# EasyEDA schematic 1-Schematic_ESP32_Wroom_mini.json
TITLE: Sheet_1; REV: 1.0; Date: 2023-05-23; Sheet: 1/1; Company: Your Company
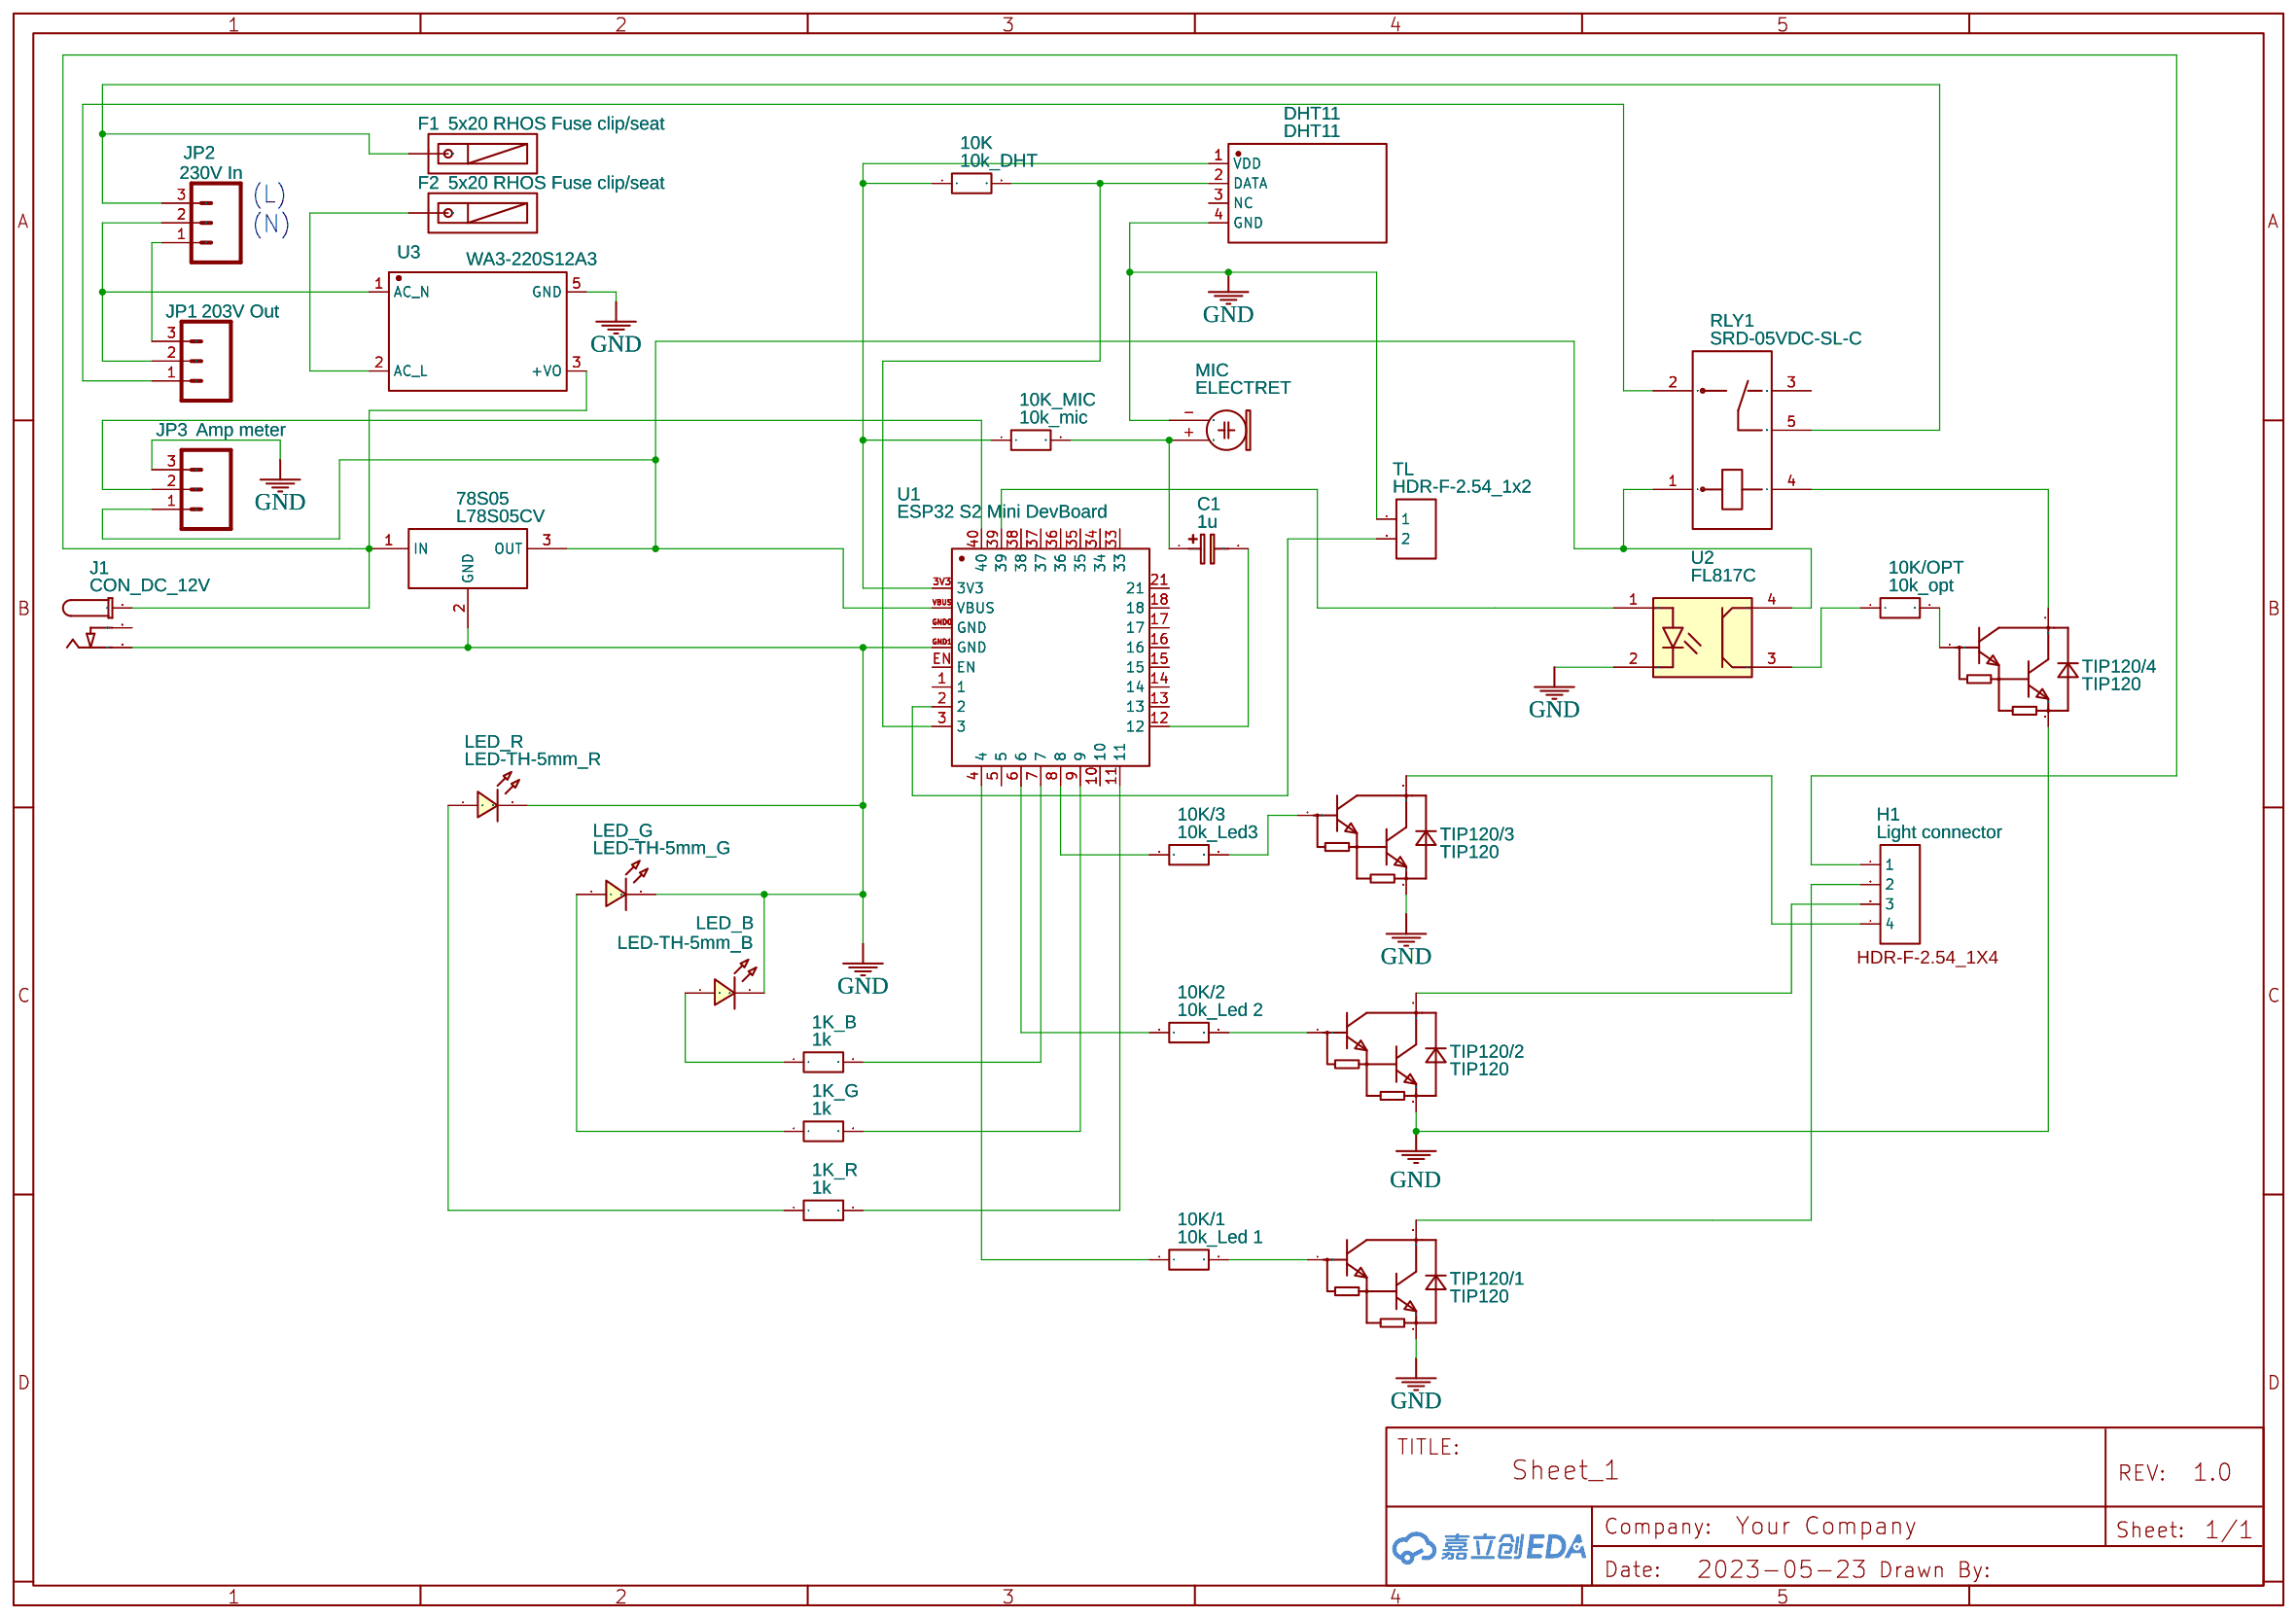
[diagram p0: schematic sheet]

## Parts
1K_B  1k  [R_AXIAL-0.4]
1K_G  1k  [R_AXIAL-0.4]
1K_R  1k  [R_AXIAL-0.4]
10K  10k_DHT  [R_AXIAL-0.4]
10K/1  10k_Led 1  [R_AXIAL-0.4]
10K/2  10k_Led 2  [R_AXIAL-0.4]
10K/3  10k_Led3  [R_AXIAL-0.4]
10K/OPT  10k_opt  [R_AXIAL-0.4]
10K_MIC  10k_mic  [R_AXIAL-0.4]
78S05  L78S05CV  [TO-220-3_L10.0-W4.5-P2.54-L]
C1  1u  [CAP-D3.0×F1.5]
DHT11  DHT11  [SENSOR-TH_DHT11]
F1  5x20 RHOS Fuse clip/seat  [FUSE-TH_5X20RHOSFUSECLIP-SEAT]
F2  5x20 RHOS Fuse clip/seat  [FUSE-TH_5X20RHOSFUSECLIP-SEAT]
H1  Light connector  [HDR-F-2.54_1X4]
J1  CON_DC_12V  [DC_BARREL_JACK_PTH_2MM]
JP1  203V Out  [SCREWTERMINAL-3.5MM-3_LOCK.007S]
JP2  230V In  [SCREWTERMINAL-3.5MM-3_LOCK.007S]
JP3  Amp meter  [SCREWTERMINAL-3.5MM-3_LOCK.007S]
LED_B  LED-TH-5mm_B  [LED-TH_BD5.0_BLUE]
LED_G  LED-TH-5mm_G  [LED-TH_BD5.0_GREEN]
LED_R  LED-TH-5mm_R  [LED-TH_BD5.0_RED]
MIC  ELECTRET  [9.7ELECTRET]
RLY1  SRD-05VDC-SL-C  [RELAY-TH_SRD-XXVDC-XL-C]
TIP120/1  TIP120  [TO-220-3_L10.0-W4.5-P2.54-L]
TIP120/2  TIP120  [TO-220-3_L10.0-W4.5-P2.54-L]
TIP120/3  TIP120  [TO-220-3_L10.0-W4.5-P2.54-L]
TIP120/4  TIP120  [TO-220-3_L10.0-W4.5-P2.54-L]
TL  HDR-F-2.54_1x2  [HDR-F-2.54_1X2]
U1  ESP32 S2 Mini DevBoard  [ESP32 FP]
U2  FL817C  [FL817C-PCB]
U3  WA3-220S12A3  [PWRM-TH_WA3-220S12A3]

## Library data of the parts
1K_B 1K_G 1K_R = R_AXIAL-0.3_EU: Contributor: LCEDA_Lib
10K 10K/1-10K/3 10K/OPT 10K_MIC = R_AXIAL-0.4_EU: Contributor: LCEDA_Lib
78S05 = L78S05CV: Supplier: LCSC; Manufacturer: ST(意法半导体); Supplier Part: C33043; JLCPCB Part Class: Extended Part
C1 = CE_TH_D3.0×F1.5_EU: Contributor: LCEDA_Lib
DHT11 = DHT11: Supplier: LCSC; Supplier Part: C117051; Manufacturer: 广州奥松; Contributor: LCSC; JLCPCB Part Class: Extended Part
F1 F2 = 5x20 RHOS Fuse clip/seat: Supplier: LCSC; Manufacturer: xcfuse(旭程); Manufacturer Part: 5x20 环保 保险管夹/座; Contributor: LCSC; Supplier Part: C3130; JLCPCB Part Class: Extended Part
H1 = HDR-F-2.54_1x4: Supplier Part: C225501; Supplier: LCSC; Contributor: LCEDA_Lib; Package Display: Yes
J1 = CON_DC_M-DC_PTH: DC power connector; Contributor: DangerousPrototype
JP1-JP3 = M03: Contributor: SparkFun
LED_B = LED-TH-5mm_B: Supplier: LCSC; Contributor: LCEDA_Lib
LED_G = LED-TH-5mm_G: Manufacturer: EVERLIGHT(台湾亿光); Manufacturer Part: 333-2SYGD/S530-E2; Supplier Part: C88163; Supplier: LCSC; Contributor: LCEDA_Lib
LED_R = LED-TH-5mm_R: Manufacturer: EVERLIGHT(台湾亿光); Manufacturer Part: 333-2SURD/S530-A3; Supplier Part: C87271; Supplier: LCSC; Contributor: LCEDA_Lib
MIC = ELECTRET: Contributor: Adafruit
RLY1 = SRD-05VDC-SL-C: Supplier: LCSC; Manufacturer: 松乐; Supplier Part: C35449; JLCPCB Part Class: Extended Part
TIP120/1-TIP120/4 = TIP120: Supplier: LCSC; Supplier Part: C262990; Manufacturer: ST(意法半导体); Contributor: LCSC; JLCPCB Part Class: Extended Part
TL = HDR-F-2.54_1x2: Supplier Part: C49661; Supplier: LCSC; Contributor: LCEDA_Lib
U1 = ESP32 S2 Mini DevBoard: Contributor: chamussy.adrien
U2 = FL817C: Manufacturer: FANGJING; link: https://e6n3v2t9.stackpathcdn.com/wp-content/uploads/2021/01/FL817.pdf; Contributor: rezataha
U3 = WA3-220S12A3: Supplier: LCSC; Manufacturer: AIPULNION(爱浦电子); Supplier Part: C98698; JLCPCB Part Class: Extended Part

## Nets
GND: 78S05.2(GND) DHT11.4(GND) J1.P3(P2) JP3.3 LED_B.2 LED_G.2 LED_R.2 MIC.-(1) TIP120/1.3(E) TIP120/2.3(E) TIP120/3.3(E) TIP120/4.3(E) TL.1 U1.GND1(GND) U2.2 U3.5(GND)
Net-(1K_B-1): 1K_B.1 LED_B.1
Net-(1K_B-2): 1K_B.2 U1.7
Net-(1K_G-1): 1K_G.1 LED_G.1
Net-(1K_G-2): 1K_G.2 U1.9
Net-(1K_R-1): 1K_R.1 LED_R.1
Net-(1K_R-2): 1K_R.2 U1.11
Net-(10K-1): 10K.1 10K_MIC.1 DHT11.1(VDD) U1.3V3
Net-(10K-2): 10K.2 DHT11.2(DATA) U1.3
Net-(10K/1-1): 10K/1.1 U1.4
Net-(10K/1-2): 10K/1.2 TIP120/1.1(B)
Net-(10K/2-1): 10K/2.1 U1.6
Net-(10K/2-2): 10K/2.2 TIP120/2.1(B)
Net-(10K/3-1): 10K/3.1 U1.8
Net-(10K/3-2): 10K/3.2 TIP120/3.1(B)
Net-(10K/OPT-1): 10K/OPT.1 U2.3
Net-(10K/OPT-2): 10K/OPT.2 TIP120/4.1(B)
Net-(10K_MIC-2): 10K_MIC.2 C1.1 MIC.+(2)
Net-(78S05-1): 78S05.1(IN) H1.1 J1.P1 U3.3(+VO)
Net-(78S05-3): 78S05.3(OUT) JP3.1 RLY1.1 U1.VBUS U2.4
Net-(C1-2): C1.2 U1.12
Net-(F1-1): F1.1 JP2.3 RLY1.5
Net-(F2-1): F2.1 U3.2(AC_L)
Net-(H1-2): H1.2 TIP120/1.2(C)
Net-(H1-3): H1.3 TIP120/2.2(C)
Net-(H1-4): H1.4 TIP120/3.2(C)
Net-(JP1-1): JP1.1 RLY1.2
Net-(JP1-2): JP1.2 JP2.2 U3.1(AC_N)
Net-(JP1-3): JP1.3 JP2.1
Net-(JP3-2): JP3.2 U1.40
Net-(RLY1-4): RLY1.4 TIP120/4.2(C)
Net-(TL-2): TL.2 U1.2
Net-(U1-39): U1.39 U2.1

Not connected (* = marked no-connect by the designer): DHT11 3(NC); J1 P2(P3); RLY1 3; U1 1 5 10 13 14 15 16 17 18 21 33 34 35 36 37 38 EN GND0(GND)

## Notes on the sheet
- (L)
- (N)
